# EAGLE design marquee_h (EAGLE 9.3.1)
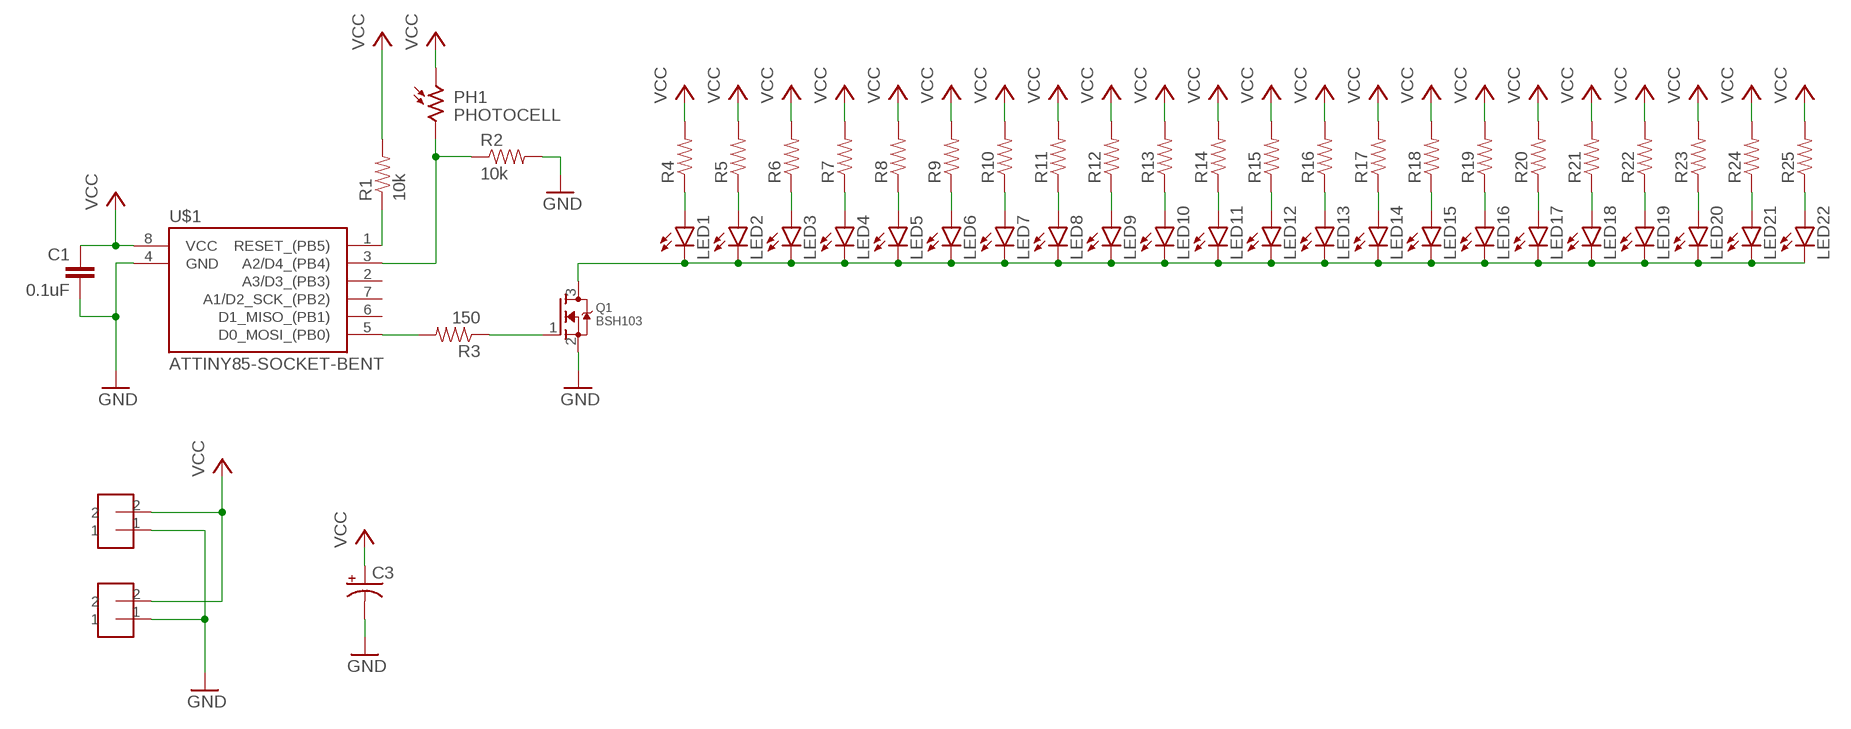
[diagram p0: schematic, sheet 1]

## Parts
C1  0.1uF  CAP-0805  [0805]
C3  CAP_POLD  [PANASONIC_D]
LED1  LED0603  [LED-0603]
LED2  LED0603  [LED-0603]
LED3  LED0603  [LED-0603]
LED4  LED0603  [LED-0603]
LED5  LED0603  [LED-0603]
LED6  LED0603  [LED-0603]
LED7  LED0603  [LED-0603]
LED8  LED0603  [LED-0603]
LED9  LED0603  [LED-0603]
LED10  LED0603  [LED-0603]
LED11  LED0603  [LED-0603]
LED12  LED0603  [LED-0603]
LED13  LED0603  [LED-0603]
LED14  LED0603  [LED-0603]
LED15  LED0603  [LED-0603]
LED16  LED0603  [LED-0603]
LED17  LED0603  [LED-0603]
LED18  LED0603  [LED-0603]
LED19  LED0603  [LED-0603]
LED20  LED0603  [LED-0603]
LED21  LED0603  [LED-0603]
LED22  LED0603  [LED-0603]
PH1  PHOTOCELL  [PHOTOCELL_ADAFRUIT]
Q1  BSH103  MOSFET-NREFLOW  [SOT23]
R1  10k  RESISTOR-0805  [0805]
R2  10k  RESISTOR-0805  [0805]
R3  150  RESISTOR-0805  [0805]
R4  RESISTOR0603  [0603-RES]
R5  RESISTOR0603  [0603-RES]
R6  RESISTOR0603  [0603-RES]
R7  RESISTOR0603  [0603-RES]
R8  RESISTOR0603  [0603-RES]
R9  RESISTOR0603  [0603-RES]
R10  RESISTOR0603  [0603-RES]
R11  RESISTOR0603  [0603-RES]
R12  RESISTOR0603  [0603-RES]
R13  RESISTOR0603  [0603-RES]
R14  RESISTOR0603  [0603-RES]
R15  RESISTOR0603  [0603-RES]
R16  RESISTOR0603  [0603-RES]
R17  RESISTOR0603  [0603-RES]
R18  RESISTOR0603  [0603-RES]
R19  RESISTOR0603  [0603-RES]
R20  RESISTOR0603  [0603-RES]
R21  RESISTOR0603  [0603-RES]
R22  RESISTOR0603  [0603-RES]
R23  RESISTOR0603  [0603-RES]
R24  RESISTOR0603  [0603-RES]
R25  RESISTOR0603  [0603-RES]
U$1  ATTINY85-SOCKET-BENT  [SOCKET-8PIN-BENT]
U$2  HEADER-2  [HEADER-2]
U$3  HEADER-2  [HEADER-2]

## Nets
GND: C1.2 C3.- Q1.2(S) R2.2 U$1.4(GND) U$2.1 U$3.1
GND_LED: LED1.C LED2.C LED3.C LED4.C LED5.C LED6.C LED7.C LED8.C LED9.C LED10.C LED11.C LED12.C LED13.C LED14.C LED15.C LED16.C LED17.C LED18.C LED19.C LED20.C LED21.C LED22.C Q1.3(D)
N$1: LED1.A R4.1
N$3: R3.2 U$1.5(D0_MOSI_(PB0))
N$5: Q1.1(G) R3.1
N$7: LED2.A R5.1
N$8: LED3.A R6.1
N$9: LED4.A R7.1
N$10: LED5.A R8.1
N$11: LED6.A R9.1
N$12: LED7.A R10.1
N$13: LED8.A R11.1
N$14: LED9.A R12.1
N$15: LED10.A R13.1
N$16: LED11.A R14.1
N$17: LED12.A R15.1
N$18: LED13.A R16.1
N$19: LED14.A R17.1
N$20: LED15.A R18.1
N$21: LED16.A R19.1
N$22: LED17.A R20.1
N$23: LED18.A R21.1
N$24: LED19.A R22.1
N$25: LED20.A R23.1
N$26: LED21.A R24.1
N$27: LED22.A R25.1
RESET: R1.1 U$1.1(RESET_(PB5))
SENSOR: PH1.2 R2.1 U$1.3(A2/D4_(PB4))
VCC: C1.1 C3.+ PH1.1 R1.2 R4.2 R5.2 R6.2 R7.2 R8.2 R9.2 R10.2 R11.2 R12.2 R13.2 R14.2 R15.2 R16.2 R17.2 R18.2 R19.2 R20.2 R21.2 R22.2 R23.2 R24.2 R25.2 U$1.8(VCC) U$2.2 U$3.2
Unconnected: U$1.2(A3/D3_(PB3)) U$1.6(D1_MISO_(PB1)) U$1.7(A1/D2_SCK_(PB2))

## Library data of the parts
C1 = homemade-hardware:CAP: Capacitor Standard 0603 ceramic capacitor, and 0.1" leaded capacitor.
C3 = homemade-hardware:CAP_POL: Capacitor Polarized These are standard SMD and PTH capacitors. Normally 10uF, 47uF, and 100uF in electrolytic and tantalum varieties. Always verify the external diameter of the through hole cap, it varies with capacity, voltage, and manufacturer. The EIA devices should be standard.
LED1-LED22 = homemade-hardware:LED: LEDs Standard schematic elements and footprints for 5mm, 3mm, 1206, and 0603 sized LEDs. 5mm - Spark Fun Electronics SKU : COM-00529 (and others)
PH1 = homemade-hardware:PHOTOCELL: 161 (Adafruit) <https://www.digikey.com/product-detail/en/adafruit-industries-llc/161/1528-2141-ND/7244927?utm_adgroup=Sensors%20&%20Transducers>: 200k Ohm photocell
Q1 = adafruit:MOSFET-N: N-Channel Mosfet 2N7002E - 60V 260mA SOT23 [Digikey: 2N7002ET1GOSTR-ND] - REEL BSH103 - 30V 850mA SOT23 [Digikey: 568-5013-1-ND]
R1-R25 = homemade-hardware:RESISTOR: Resistor Basic schematic elements and footprints for 0603, 1206, and PTH resistors.
U$1 = homemade-hardware:ATTINY85
U$2 U$3 = homemade-hardware:HEADER-2

## Board
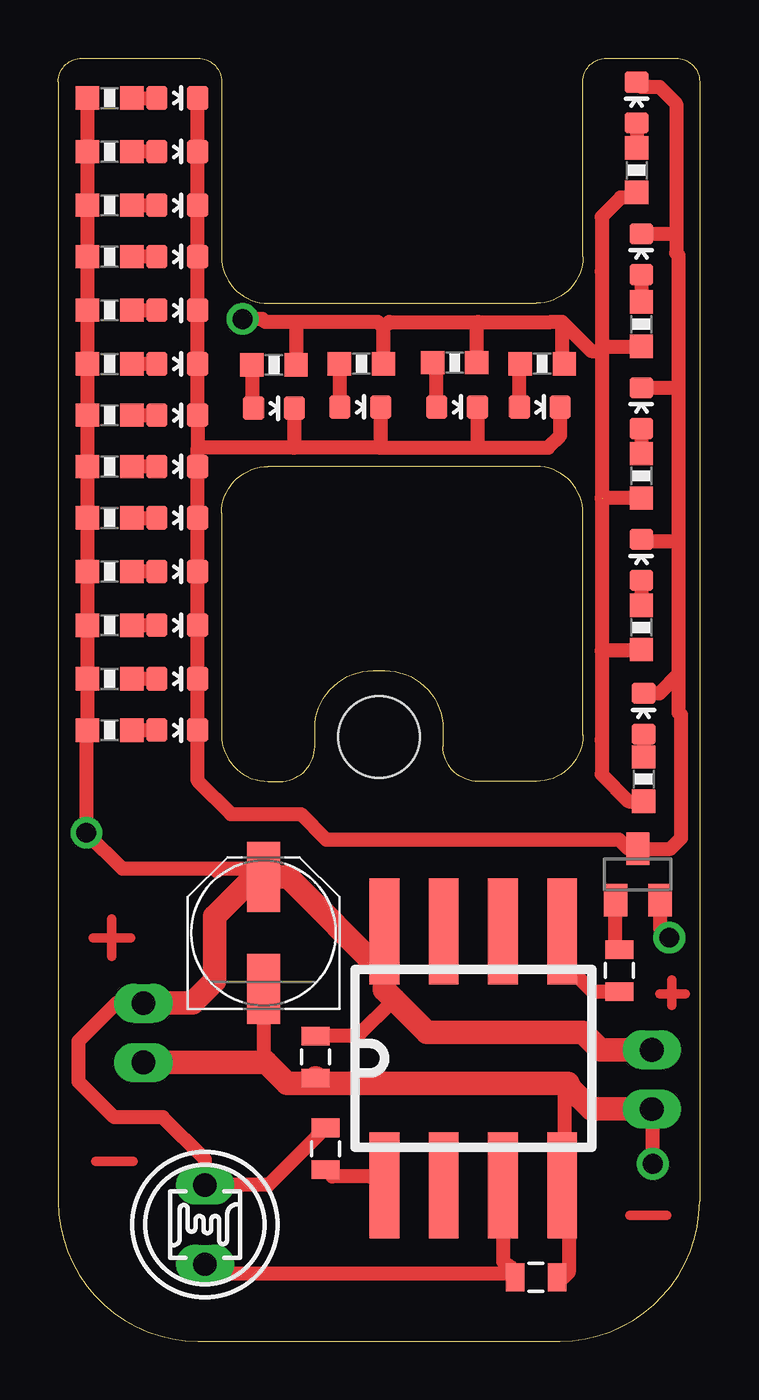
[diagram p1: board, top side]
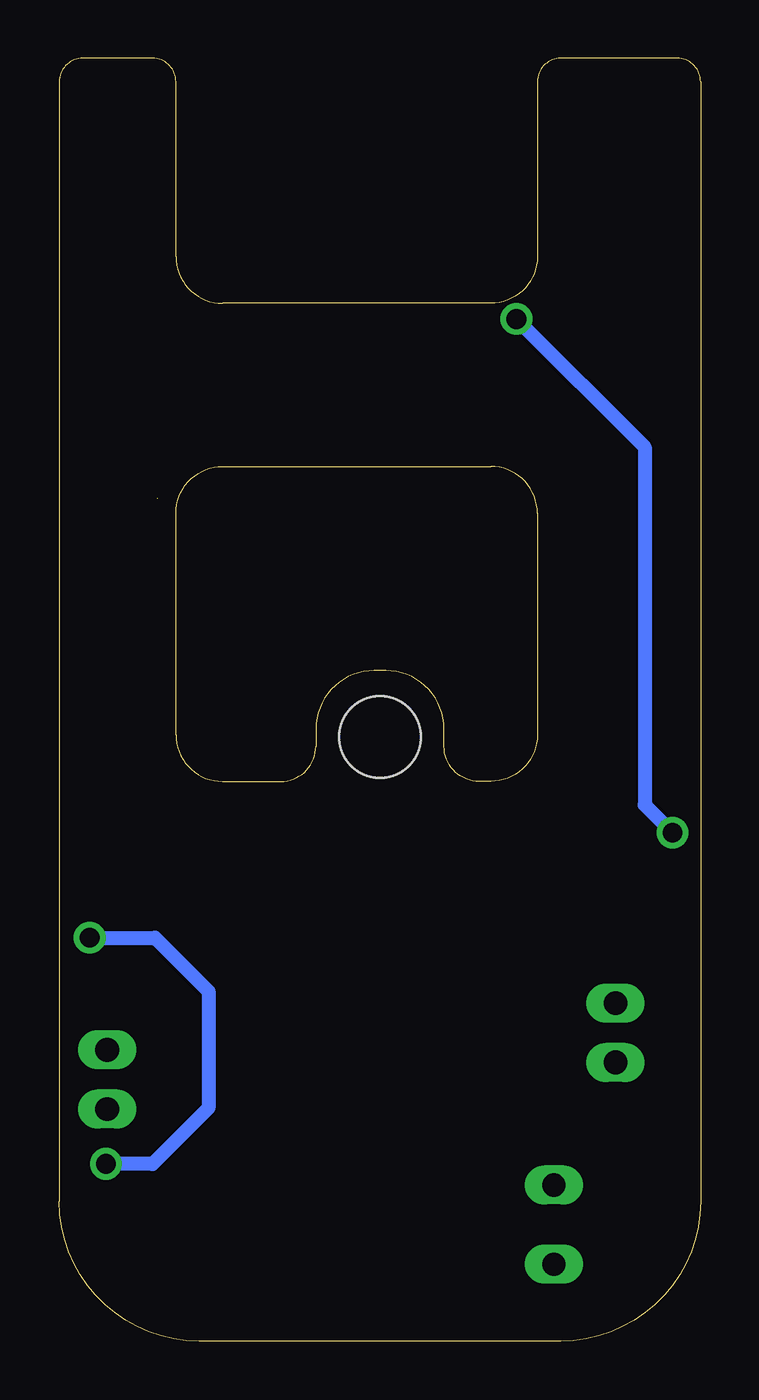
[diagram p2: board, bottom side, seen from below]

Size 27.5 x 55 mm. Coordinates in mm from the lower left corner, seen from the top.
Outline: 0,54 0,6 arc90 6,0 21.5,0 arc90 27.5,6 27.5,54 arc90 26.5,55 23.5,55 arc90 22.5,54 22.5,46.5 arc-90 20.5,44.5 9,44.5 arc-90 7,46.5 7,54 arc90 6,55 1,55 arc90 0,54
Outline: 22.5,26 22.5,35.5 arc90 20.5,37.5 9,37.5 arc90 7,35.5 7,26 arc90 9,24 9.5,24 arc90 11,25.5 11,26.25 arc-90 13.5,28.75 14,28.75 arc-90 16.5,26.25 16.5,25.5 arc90 18,24 20.5,24 arc90 22.5,26
Copper layers (1*16): Top 0.035mm / dielectric 1.5mm / Bottom 0.035mm
Design rules "BantamDRC_30_deg_v2": minimum track width 6mil, minimum drill 0.8mm, track to track 6mil, track to pad 6mil, pad to pad 6mil, via to via 6mil, smd to smd 0mil, copper to edge 0mil, drill to drill 6mil, minimum pad ring 10mil, minimum via ring 10mil, stop-mask expansion 1mil, vias tented up to drill 30mil, thermal gap 6mil
Holes 3.5 mm at 13.75,25.9

### Footprints (pad centres in the part's own frame; a part is rotated, then mirrored left to right if it is on the bottom)
0805 = smd 0.8 x 1.2: 1 -0.9,0; 2 0.9,0
PANASONIC_D = smd 3 x 1.4: + 2.4,0; - -2.4,0
LED-0603 = smd 1 x 0.9: A 0,-0.877; C 0,0.877
PHOTOCELL_ADAFRUIT = drill 1 pad 1.676 long: 1 -1.7,0; 2 1.7,0
SOT23 = smd 1 x 1.4: 1 -0.95,-1.1; 2 0.95,-1.1; 3 0,1.1
0603-RES = smd 1 x 1: 1 -0.95,0; 2 0.95,0
SOCKET-8PIN-BENT = smd 4.54 x 1.27: 1 -5.445,3.81; 2 -5.445,1.27; 3 -5.445,-1.27; 4 -5.445,-3.81; 5 5.445,-3.81; 6 5.445,-1.27; 7 5.445,1.27; 8 5.445,3.81
HEADER-2 = drill 1.016 pad 1.676 long: 1 0,0; 2 0,2.54

### Placement (x,y rotation side)
C1  11.04,12.18 270 top
C3  8.8,17.5 90 top
LED1  5.1,30.7 270 top
LED2  5.1,33 270 top
LED3  5.1,35.3 270 top
LED4  5.1,37.5 270 top
LED5  5.1,39.7 270 top
LED6  5.1,44.2 270 top
LED7  5.1,41.9 270 top
LED8  5.1,48.7 270 top
LED9  5.1,51 270 top
LED10  5.1,53.3 270 top
LED11  5.1,46.5 270 top
LED12  5.1,28.4 270 top
LED13  25,46.6 0 top
LED14  25.1,26.9 0 top
LED15  25,33.5 0 top
LED16  5.1,26.2 270 top
LED17  24.8,53.1 0 top
LED18  17.1,40.05 270 top
LED19  9.25,40 270 top
LED20  25,40 0 top
LED21  20.65,40.05 270 top
LED22  12.95,40.05 270 top
PH1  6.29,5 270 top
Q1  24.85,20.01 0 top
R1  11.46,8.25 90 top
R2  20.49,2.75 0 top
R3  24.06,15.89 270 top
R4  2.2,30.7 180 top
R5  2.2,33 180 top
R6  2.2,35.3 180 top
R7  2.2,37.5 180 top
R8  2.2,39.7 180 top
R9  2.2,44.2 180 top
R10  2.2,41.9 180 top
R11  2.2,48.7 180 top
R12  2.2,51 180 top
R13  2.2,53.3 180 top
R14  2.2,46.5 180 top
R15  2.2,28.4 180 top
R16  25,43.6 270 top
R17  25.1,24.1 270 top
R18  25,30.6 270 top
R19  2.2,26.2 180 top
R20  24.8,50.2 270 top
R21  17,41.95 0 top
R22  9.25,41.85 0 top
R23  25,37.1 270 top
R24  20.75,41.9 0 top
R25  13,41.9 0 top
U$1  17.8,12.13 90 top
U$2  25.45,9.95 0 top
U$3  3.65,11.95 0 top

### Tracks (layer width: path | path; a pad name or v marks a point on that pad's centre or on a via)
GND  (via drill 0.85)
  Top 0.61: 21.85,11.05 22.01,10.89 22.01,10.79 22.01,10.69 | 21.71,10.99 21.71,6.79 U$1.4 21.89,6.41 21.89,2.95 21.69,2.75 R2.2 | 25.8,18.7 Q1.2 25.8,17.7 v26.2,17.3 | 11.37,11.05 11.27,11.05 | C3.- 8.8,12.05 | v25.5,7.6 25.5,9.9 U$2.1
  Top 1.016: 21.85,11.05 11.37,11.05 | 8.9,11.95 9.8,11.05 11.27,11.05 C1.2 | 8.9,11.95 8.8,12.05 | U$2.1 22.85,9.95 22.01,10.79 | 22.01,10.69 21.71,10.99 | 8.9,11.95 U$3.1
  Bottom 0.61: v26.2,17.3 23.4,17.3 21.1,15 21.1,10 23.5,7.6 v25.5,7.6
GND_LED
  Top 0.61: 5.98,38.3 LED4.C LED3.C LED2.C LED1.C LED12.C LED16.C 5.98,24.02 7.4,22.6 10.4,22.6 11.5,21.5 24.06,21.5 24.45,21.11 Q1.3 26.25,21.11 26.7,21.56 26.7,26.85 26.6,26.95 26.6,28.6 | LED10.C LED9.C LED8.C LED11.C LED6.C LED7.C LED5.C 5.98,38.3 | 13.8,38.3 10.1,38.3 | 10.1,38.3 5.98,38.3 | 13.8,38.3 18,38.3 | 18,38.3 21,38.3 21.53,38.83 LED21.C | LED22.C 13.83,38.33 13.8,38.3 | LED18.C 17.98,38.33 18,38.3 | LED19.C 10.1,39.97 10.1,38.3 | LED17.C 25,53.77 25.78,53.77 26.5,53.05 26.5,47.4 | 26.6,40.9 26.6,46.55 26.5,46.65 26.5,47.4 | 26.6,40.9 26.6,34.3 | 26.6,34.3 26.6,28.6 | LED14.C 25.78,27.78 26.6,28.6 | LED15.C 25.08,34.3 26.6,34.3 | LED20.C 26.58,40.88 26.6,40.9 | LED13.C 26.42,47.48 26.5,47.4
N$1
  Top 0.61: R4.1 LED1.A
N$2
  Top 0.406: 1.5,17.3 3.1,17.3
N$3
  Top 0.61: 21.61,17.49 U$1.5 21.61,16.29 22.91,14.99 R3.2
N$4
  Top 0.406: 2.3,16.5 2.3,18.1
N$5
  Top 0.61: R3.1 23.9,16.95 Q1.1
N$6
  Top 0.406: 1.6,7.7 3.2,7.7
N$7
  Top 0.61: LED2.A R5.1
N$8
  Top 0.61: R6.1 LED3.A
N$9
  Top 0.61: LED4.A R7.1
N$10
  Top 0.61: R8.1 LED5.A
N$11
  Top 0.61: R9.1 LED6.A
N$12
  Top 0.61: LED7.A R10.1
N$13
  Top 0.61: R11.1 LED8.A
N$14
  Top 0.61: LED9.A R12.1
N$15
  Top 0.61: R13.1 LED10.A
N$16
  Top 0.61: LED11.A R14.1
N$17
  Top 0.61: LED12.A R15.1
N$18
  Top 0.61: LED13.A R16.1
N$19
  Top 0.61: LED14.A R17.1
N$20
  Top 0.61: LED15.A R18.1
N$21
  Top 0.61: R19.1 LED16.A
N$22
  Top 0.61: LED17.A R20.1
N$23
  Top 0.61: LED18.A 16.22,41.78 R21.1
N$24
  Top 0.61: R22.1 8.3,40.07 LED19.A
N$25
  Top 0.61: LED20.A R23.1
N$26
  Top 0.61: LED21.A 19.77,41.87 R24.1
N$27
  Top 0.61: LED22.A 12.07,41.88 R25.1
N$28
  Top 0.406: 26.3,14.4 26.3,15.5
N$29
  Top 0.406: 25.8,14.9 26.9,14.9
N$30
  Top 0.406: 24.5,5.4 26.1,5.4
RESET
  Top 0.61: U$1.1 13.37,7.06 11.75,7.06 R1.1
SENSOR
  Top 0.61: U$1.3 19.07,3.41 19.47,3.12 19.47,2.9 19.38,2.9 | R2.1 19.38,2.9 | PH1.2 6.69,2.9 19.38,2.9
VCC  (via drill 0.85)  (1 unrouted)
  Top 0.61: 13.94,16.57 U$1.8 | U$1.8 13.99,17.3 | U$1.8 14.1,17.46 14.1,15.95 | R13.2 R12.2 R11.2 R14.2 R9.2 R10.2 R8.2 R7.2 R6.2 R5.2 R4.2 R15.2 R19.2 1.2,26.15 v1.2,21.8 2.75,20.25 6.7,20.25 | R25.2 13.95,43.45 | 13.95,43.45 13.71,43.7 10.2,43.7 | 10.2,43.7 R22.2 | 13.95,43.45 14.2,43.7 18,43.7 | 18,43.7 21.13,43.7 21.6,43.7 | 21.6,43.7 21.6,42 R24.2 | R21.2 17.95,43.65 18,43.7 | 10.2,43.7 8.87,43.7 8.75,43.82 v7.9,43.82 | 21.6,43.7 22.85,42.45 23.3,42.45 | 23.3,42.65 R16.2 | R20.2 24.58,49.03 24.12,49.03 23.3,48.21 23.3,45.87 23.3,42.65 | 23.3,42.65 23.3,42.45 | 23.3,42.45 23.3,36.15 R23.2 | 23.3,36.13 23.3,29.6 | 23.3,29.6 23.3,25.78 23.3,25.77 23.3,24.3 24.45,23.15 R17.2 | R18.2 24.95,29.6 23.3,29.6 | C1.1 12.84,13.08 14.39,14.63 14.39,14.66 | C3.+ 8.45,20.25 6.7,20.25 | 6.8,20.15 6.7,20.25 | R1.2 9.01,6.7 PH1.1 6.29,7.79 4.48,9.6 2.4,9.6 0.88,11.12 0.88,12.88 2.5,14.5 U$3.2
  Top 1.016: U$2.2 23.25,12.49 22.49,13.25 15.8,13.25 14.39,14.66 13.99,15.06 U$1.8 13.98,15.77 9.85,19.9 C3.+ 8.4,19.9 6.7,18.2 6.7,15.45 5.75,14.5 U$3.2
  Bottom 0.61: v7.9,43.82 2.4,38.32 2.4,23 v1.2,21.8